# EAGLE design eos-mc-one (EAGLE 9.6.2)
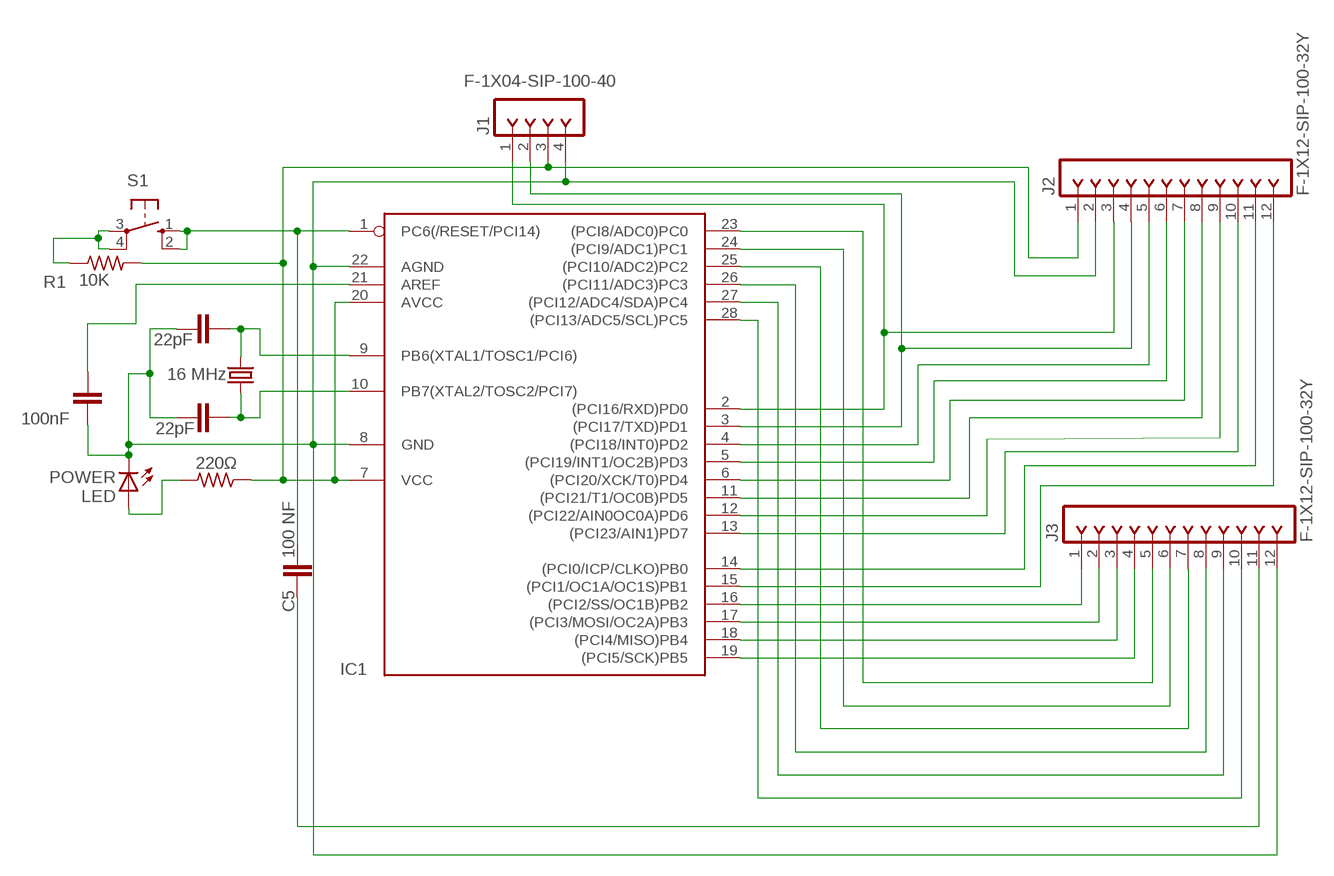
[diagram p0: schematic, sheet 1]

## Parts
C1  22pF  C2,5-3  [C2.5-3]
C2  22pF  C2,5-3  [C2.5-3]
C3  100nF  C2,5-3  [C2.5-3]
C5  100 NF  C2,5-3  [C2.5-3]
IC1  ATMEGA328-20P  [DIL28-3]
J1  F-1X04-SIP-100-40  [SIP-100-04-40]
J2  F-1X12-SIP-100-32Y  [SIP-100-12-32Y]
J3  F-1X12-SIP-100-32Y  [SIP-100-12-32Y]
LED3  LED5MM  [LED5MM]
Q1  16 MHz  CRYSTALHC49S  [HC49/S]
R1  10K  FLIPFLOP-RES  [0805-THM]
R5  220Ω  FLIPFLOP-RES  [0805-THM]
S1  10-XX  [B3F-10XX]

## Nets
N$1: C1.2 IC1.9(PB6(XTAL1/TOSC1/PCI6)) Q1.2
N$2: C2.2 IC1.10(PB7(XTAL2/TOSC2/PCI7)) Q1.1
N$3: LED3.A R5.2
N$4: C1.1 C2.1 C3.1 IC1.8(GND) IC1.22(AGND) J1.4 J2.2 J3.12 LED3.K(C)
N$5: IC1.4((PCI18/INT0)PD2) J2.5
N$6: IC1.2((PCI16/RXD)PD0) J1.1 J2.3
N$7: IC1.3((PCI17/TXD)PD1) J1.2 J2.4
N$8: IC1.7(VCC) IC1.20(AVCC) J1.3 J2.1 R1.2 R5.1
N$9: IC1.5((PCI19/INT1/OC2B)PD3) J2.6
N$10: IC1.6((PCI20/XCK/T0)PD4) J2.7
N$11: IC1.11((PCI21/T1/OC0B)PD5) J2.8
N$12: IC1.12((PCI22/AIN0OC0A)PD6) J2.9
N$13: IC1.13((PCI23/AIN1)PD7) J2.10
N$14: IC1.14((PCI0/ICP/CLKO)PB0) J2.11
N$15: IC1.15((PCI1/OC1A/OC1S)PB1) J2.12
N$16: IC1.16((PCI2/SS/OC1B)PB2) J3.1
N$17: IC1.17((PCI3/MOSI/OC2A)PB3) J3.2
N$18: IC1.18((PCI4/MISO)PB4) J3.3
N$19: IC1.19((PCI5/SCK)PB5) J3.4
N$20: IC1.23((PCI8/ADC0)PC0) J3.5
N$21: IC1.24((PCI9/ADC1)PC1) J3.6
N$22: IC1.25((PCI10/ADC2)PC2) J3.7
N$23: IC1.26((PCI11/ADC3)PC3) J3.8
N$24: IC1.27((PCI12/ADC4/SDA)PC4) J3.9
N$25: IC1.28((PCI13/ADC5/SCL)PC5) J3.10
N$26 [5V]: C5.1 J3.11
N$27: C5.2 IC1.1(PC6(/RESET/PCI14)) S1.1(S) S1.2(S1)
N$28: C3.2 IC1.21(AREF)
N$29: R1.1 S1.3(P) S1.4(P1)

## Notes on the sheet
- POWER
  LED

## Library data of the parts
C1-C3 C5 = capacitor-wima:C: CAPACITOR naming: grid - package width
IC1 = atmega328:ATMEGA328*P: MICROCONTROLLER 32 kBytes FLASH 2 kBytes SRAM 1 kBytes EEPROM USART 8-channel 10 bit ADC
J1 = con-headers-jp:F-1X04-: FEMALE HEADER
J2 J3 = con-headers-jp:F-1X12-: FEMALE HEADER
LED3 = adafruit:LED: LED OSRAM: - CHIPLED LG R971, LG N971, LY N971, LG Q971, LY Q971, LO R971, LY R971 LH N974, LH R974 LS Q976, LO Q976, LY Q976 LO Q996 - Hyper CHIPLED LW Q18S LB Q993, LB Q99A, LB R99A - SideLED LS A670, LO A670, LY A670, LG A670, LP A670 LB A673, LV A673, LT A673, LW A673 LH A674 LY A675 LS A676, LA A676, LO A676, LY A676, LW A676 LS A679, LY A679, LG A679 - Hyper Micro SIDELED® LS Y876, LA Y876, LO Y876, LY Y876 LT Y87S - SmartLED LW L88C, LW L88S LB L89C, LB L89S, LG L890 LS L89K, LO L89K, LY L89K LS L896, LA L896, LO L896, LY L896 - TOPLED LS T670, LO T670, LY T670, LG T670, LP T670 LSG T670, LSP T670, LSY T670, LOP T670, LYG T670 LG T671, LOG T671, LSG T671 LB T673, LV T673, LT T673, LW T673 LH T674 LS T676, LA T676, LO T676, LY T676, LB T676, LH T676, LSB T676, LW T676 LB T67C, LV T67C, LT T67C, LS T67K, LO T67K, LY T67K, LW E67C LS E67B, LA E67B, LO E67B, LY E67B, LB E67C, LV E67C, LT E67C LW T67C LS T679, LY T679, LG T679 LS T770, LO T770, LY T770, LG T770, LP T770 LB T773, LV T773, LT T773, LW T773 LH T774 LS E675, LA E675, LY E675, LS T675 LS T776, LA T776, LO T776, LY T776, LB T776 LHGB T686 LT T68C, LB T68C - Hyper Mini TOPLED® LB M676 - Mini TOPLED Santana® LG M470 LS M47K, LO M47K, LY M47K Source: http://www.osram.convergy.de/
Q1 = adafruit:CRYSTAL: CRYSTAL; OC_FARNELL: 1667008; OC_NEWARK: unknown
R1 R5 = adafruit:FLIPFLOP-RES: Flip Flop resistor An 0805 resistor inside a standard 1/4W 5% resistor. Makes for easy mods
S1 = switch-omron:10-XX: OMRON SWITCH; MPN: B3F-1000; OC_FARNELL: 176432; OC_NEWARK: 36M3542

## Board
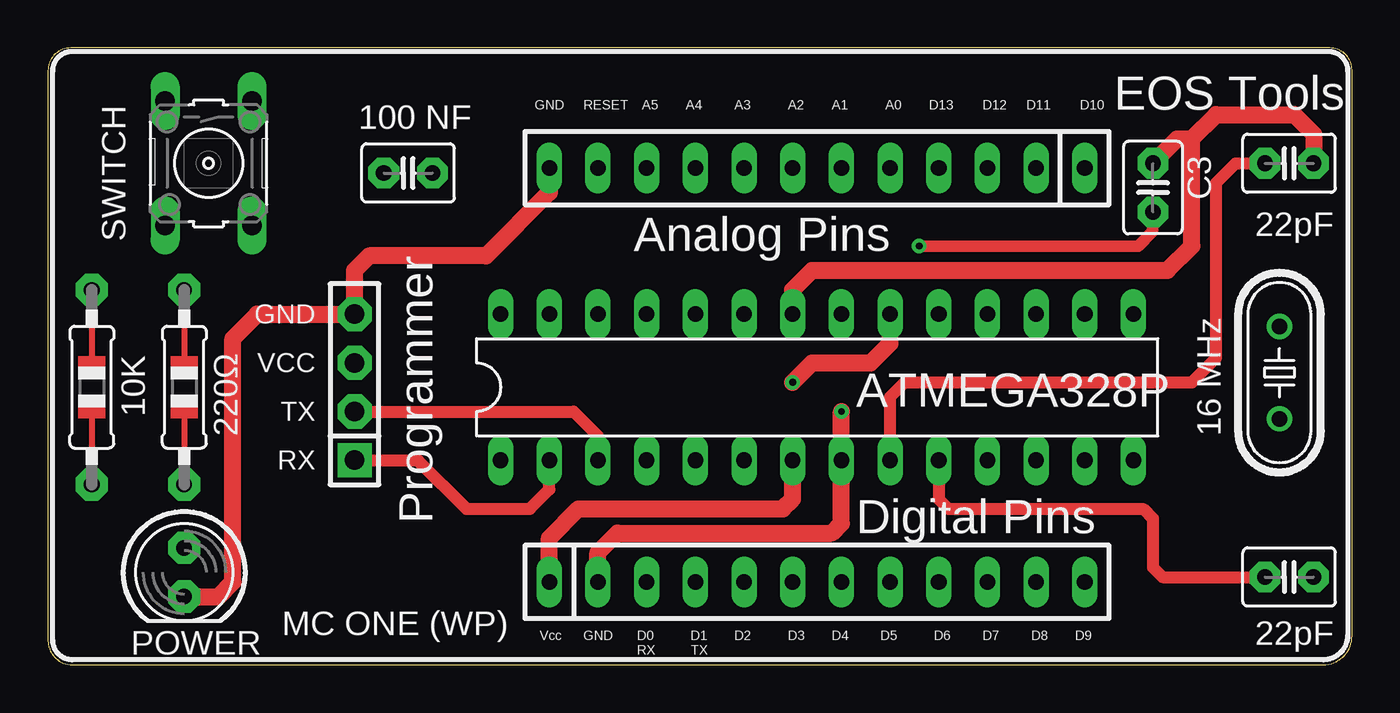
[diagram p1: board, top side]
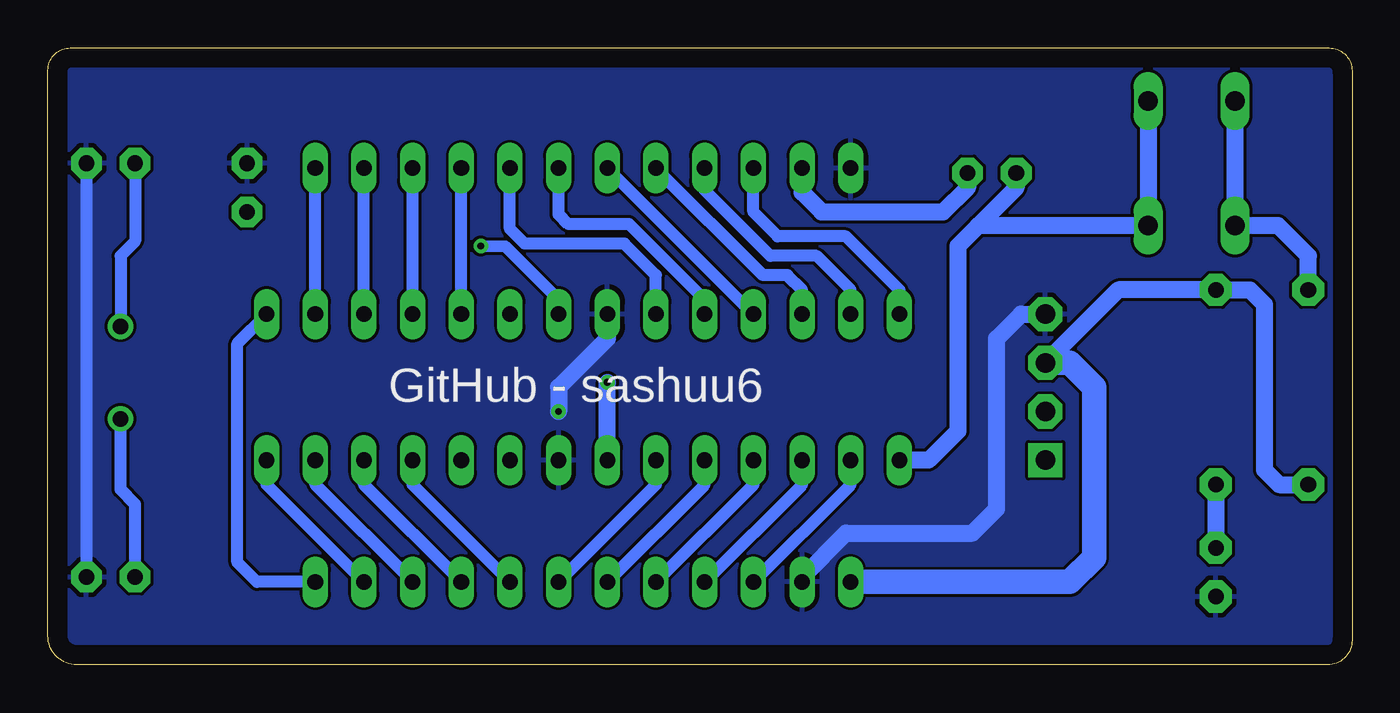
[diagram p2: board, bottom side, seen from below]

Size 68.05 x 32.18 mm. Coordinates in mm from the lower left corner, seen from the top.
Outline: 0,30.99 0,1.27 arc90 1.27,0 66.55,0 arc90 68.05,1.5 68.05,31.01 arc90 66.88,32.18 1.19,32.18 arc90 0,30.99
Copper layers (1*16): Top 0.035mm / dielectric 1.5mm / Bottom 0.035mm
Design rules "default": minimum track width 6mil, minimum drill 0.35mm, track to track 6mil, track to pad 6mil, pad to pad 6mil, via to via 6mil, smd to smd 6mil, copper to edge 40mil, drill to drill 6mil, minimum pad ring 10mil, minimum via ring 8mil, stop-mask expansion 4mil, vias tented up to drill 0mil, thermal gap 10mil

### Footprints (pad centres in the part's own frame; a part is rotated, then mirrored left to right if it is on the bottom)
C2.5-3 = drill 0.813 pad 1.6 octagon: 1 -1.27,0; 2 1.27,0
DIL28-3 = drill 0.813 long: 1 -16.51,-3.81; 2 -13.97,-3.81; 3 -11.43,-3.81; 4 -8.89,-3.81; 5 -6.35,-3.81; 6 -3.81,-3.81; 7 -1.27,-3.81; 8 1.27,-3.81; 9 3.81,-3.81; 10 6.35,-3.81; 11 8.89,-3.81; 12 11.43,-3.81; 13 13.97,-3.81; 14 16.51,-3.81; 15 16.51,3.81; 16 13.97,3.81; 17 11.43,3.81; 18 8.89,3.81; 19 6.35,3.81; 20 3.81,3.81; 21 1.27,3.81; 22 -1.27,3.81; 23 -3.81,3.81; 24 -6.35,3.81; 25 -8.89,3.81; 26 -11.43,3.81; 27 -13.97,3.81; 28 -16.51,3.81
SIP-100-04-40 = drill 1.016 pad 1.778 square: 1 -3.81,0 | drill 1.016 pad 1.778 octagon: 2 -1.27,0; 3 1.27,0; 4 3.81,0
SIP-100-12-32Y = drill 0.813 long: 1 -13.97,0; 2 -11.43,0; 3 -8.89,0; 4 -6.35,0; 5 -3.81,0; 6 -1.27,0; 7 1.27,0; 8 3.81,0; 9 6.35,0; 10 8.89,0; 11 11.43,0; 12 13.97,0
LED5MM = drill 0.813 pad 1.676 octagon: A -1.27,0; K 1.27,0
HC49/S = drill 0.813: 1 -2.413,0; 2 2.413,0
0805-THM = drill 0.813 pad 1.676 octagon: 1 -5.08,0; 2 5.08,0
B3F-10XX = drill 1.016 long: 1 -3.251,2.261; 2 3.251,2.261; 3 -3.251,-2.261; 4 3.251,-2.261

### Placement (x,y rotation side)
C1  64.77,26.16 180 top
C2  64.77,4.57 180 top
C3  57.66,24.89 270 top
C5  18.8,25.65 180 top
IC1  40.13,14.48 0 top
J1  16,14.48 90 top
J2  40.13,4.32 0 top
J3  40.13,25.91 180 top
LED3  7.11,4.83 270 top
Q1  64.26,15.24 90 top
R1  2.29,14.48 270 top
R5  7.11,14.48 270 top
S1  8.38,26.16 270 top

### Tracks (layer width: path | path; a pad name or v marks a point on that pad's centre or on a via)
N$1
  Top 0.635: IC1.9 43.94,13.97 44.7,14.73 59.69,14.73 60.96,16 60.96,25.15 61.98,26.16 C1.2
  Bottom 0.635: C1.2 63.5,22.1 64.26,21.34 Q1.2
N$2
  Top 0.635: IC1.10 46.48,8.64 46.99,8.13 57.15,8.13 57.66,7.62 57.66,5.08 58.17,4.57 C2.2
  Bottom 0.635: C2.2 63.5,8.38 64.26,9.14 Q1.1
N$3
  Bottom 0.889: R5.2 LED3.A
N$4  (via drill 0.35)
  Top 0.356: IC1.22 38.86,19.56
  Top 0.889: v41.4,13.21 IC1.8 41.4,7.37 40.89,6.86 29.72,6.86 28.7,5.84 J2.2 | LED3.K 8.89,3.56 9.65,4.32 9.65,17.02 10.92,18.29 J1.4 16,20.57 16.76,21.34 22.86,21.34 26.16,24.64 J3.12 | 38.86,19.56 39.88,20.57 58.42,20.57 59.69,21.84 59.69,27.43 | C1.1 66.04,27.69 65.02,28.7 60.96,28.7 59.69,27.43 | C3.1 58.93,27.43 59.69,27.43
  Bottom 0.635: C1.1 C2.1
  Bottom 0.889: J2.2 28.7,4.57 26.42,6.86 19.81,6.86 18.54,8.13 18.54,17.02 17.27,18.29 J1.4 | IC1.22 38.86,17.02 41.4,14.48 v41.4,13.21
  pour Bottom: 0.76,30.99 0.76,1.02 1.27,0.51 66.55,0.51 67.56,1.52 67.56,30.99 66.8,31.75 1.52,31.75
N$5
  Bottom 0.635: J2.5 31.24,9.4 IC1.4
N$6
  Top 0.635: J1.1 19.3,10.67 21.84,8.13 25.15,8.13 26.16,9.14 IC1.2
  Bottom 0.635: J2.3 26.16,9.4 IC1.2
N$7
  Top 0.356: 28.7,11.94 IC1.3
  Top 0.635: J1.2 27.43,13.21 28.7,11.94
  Bottom 0.635: J2.4 28.7,9.4 IC1.3
N$8  (via drill 0.35)
  Top 0.889: J2.1 26.16,6.6 27.69,8.13 38.35,8.13 38.86,8.64 IC1.7 | v38.86,14.73 39.88,15.75 42.93,15.75 43.94,16.76 IC1.20
  Bottom 0.889: J1.3 12.19,19.56 R5.1 5.33,19.56 4.57,18.8 4.57,10.16 3.81,9.4 R1.2 | IC1.7 v38.86,14.73
  Bottom 1.27: J2.1 14.73,4.32 13.46,5.59 13.46,14.48 14.73,15.75 J1.3
N$9
  Bottom 0.635: J2.6 33.78,9.4 IC1.5
N$10
  Bottom 0.635: J2.7 36.32,9.4 IC1.6
N$11
  Bottom 0.635: J2.8 49.02,9.4 IC1.11
N$12
  Bottom 0.635: J2.9 51.56,9.4 IC1.12
N$13
  Bottom 0.635: J2.10 54.1,9.4 IC1.13
N$14
  Bottom 0.635: J2.11 56.64,9.4 IC1.14
N$15
  Bottom 0.635: J2.12 57.15,4.32 58.17,5.33 58.17,16.76 IC1.15
N$16
  Bottom 0.635: IC1.16 J3.1
N$17
  Bottom 0.635: IC1.17 J3.2
N$18
  Bottom 0.635: IC1.18 J3.3
N$19
  Bottom 0.635: IC1.19 J3.4
N$20
  Bottom 0.635: IC1.23 36.32,20.32 37.97,21.97 43.18,21.97 43.94,22.73 J3.5
N$21
  Bottom 0.635: IC1.24 33.78,19.05 37.72,22.99 40.89,22.99 41.4,23.5 J3.6
N$22
  Bottom 0.635: J3.7 IC1.25
N$23
  Bottom 0.635: IC1.26 28.7,19.56 29.46,20.32 30.73,20.32 J3.8
N$24
  Bottom 0.635: IC1.27 26.16,19.56 27.94,21.34 30.35,21.34 33.78,24.77 J3.9
N$25
  Bottom 0.635: IC1.28 23.62,19.56 26.42,22.35 29.97,22.35 31.24,23.62 J3.10
N$26
  Bottom 0.889: J3.11 28.7,24.64 27.69,23.62 21.34,23.62 20.07,24.89 C5.1
N$27
  Bottom 0.889: IC1.1 22.1,10.67 20.57,12.19 20.57,21.84 19.51,22.91 | S1.1 S1.2 19.51,22.91 | C5.2 17.53,24.89 19.51,22.91
N$28  (via drill 0.35)
  Top 0.61: C3.2 57.66,22.61 56.9,21.84 v45.47,21.84
  Bottom 0.61: IC1.21 41.4,19.05 44.2,21.84 v45.47,21.84
N$29
  Bottom 0.889: R1.1 2.29,21.34 3.86,22.91 S1.4 S1.3

### Text on the board
tPlace: 100 NF | GND | RESET | A5 | A4 | A3 | A2 | A1 | A0 | D13 | D12 | D11 | D10 | EOS Tools | Analog Pins | SWITCH | 22pF | GND | VCC | 10K | TX | ATMEGA328P | 220Ω | 16 MHz | RX | Programmer | Digital Pins | MC ONE (WP) | Vcc | GND | D2 | D3 | D4 | D5 | D6 | D7 | D8 | D9 | 22pF | POWER | D0 / RX | D1 / TX
bPlace: GitHub - sashuu6